# EasyEDA Pro project ProPrj_UNO2FL32x8_COMM_pro_2026-06-11.epro, schematic ISC_UNO2FL32x8_COMM_1
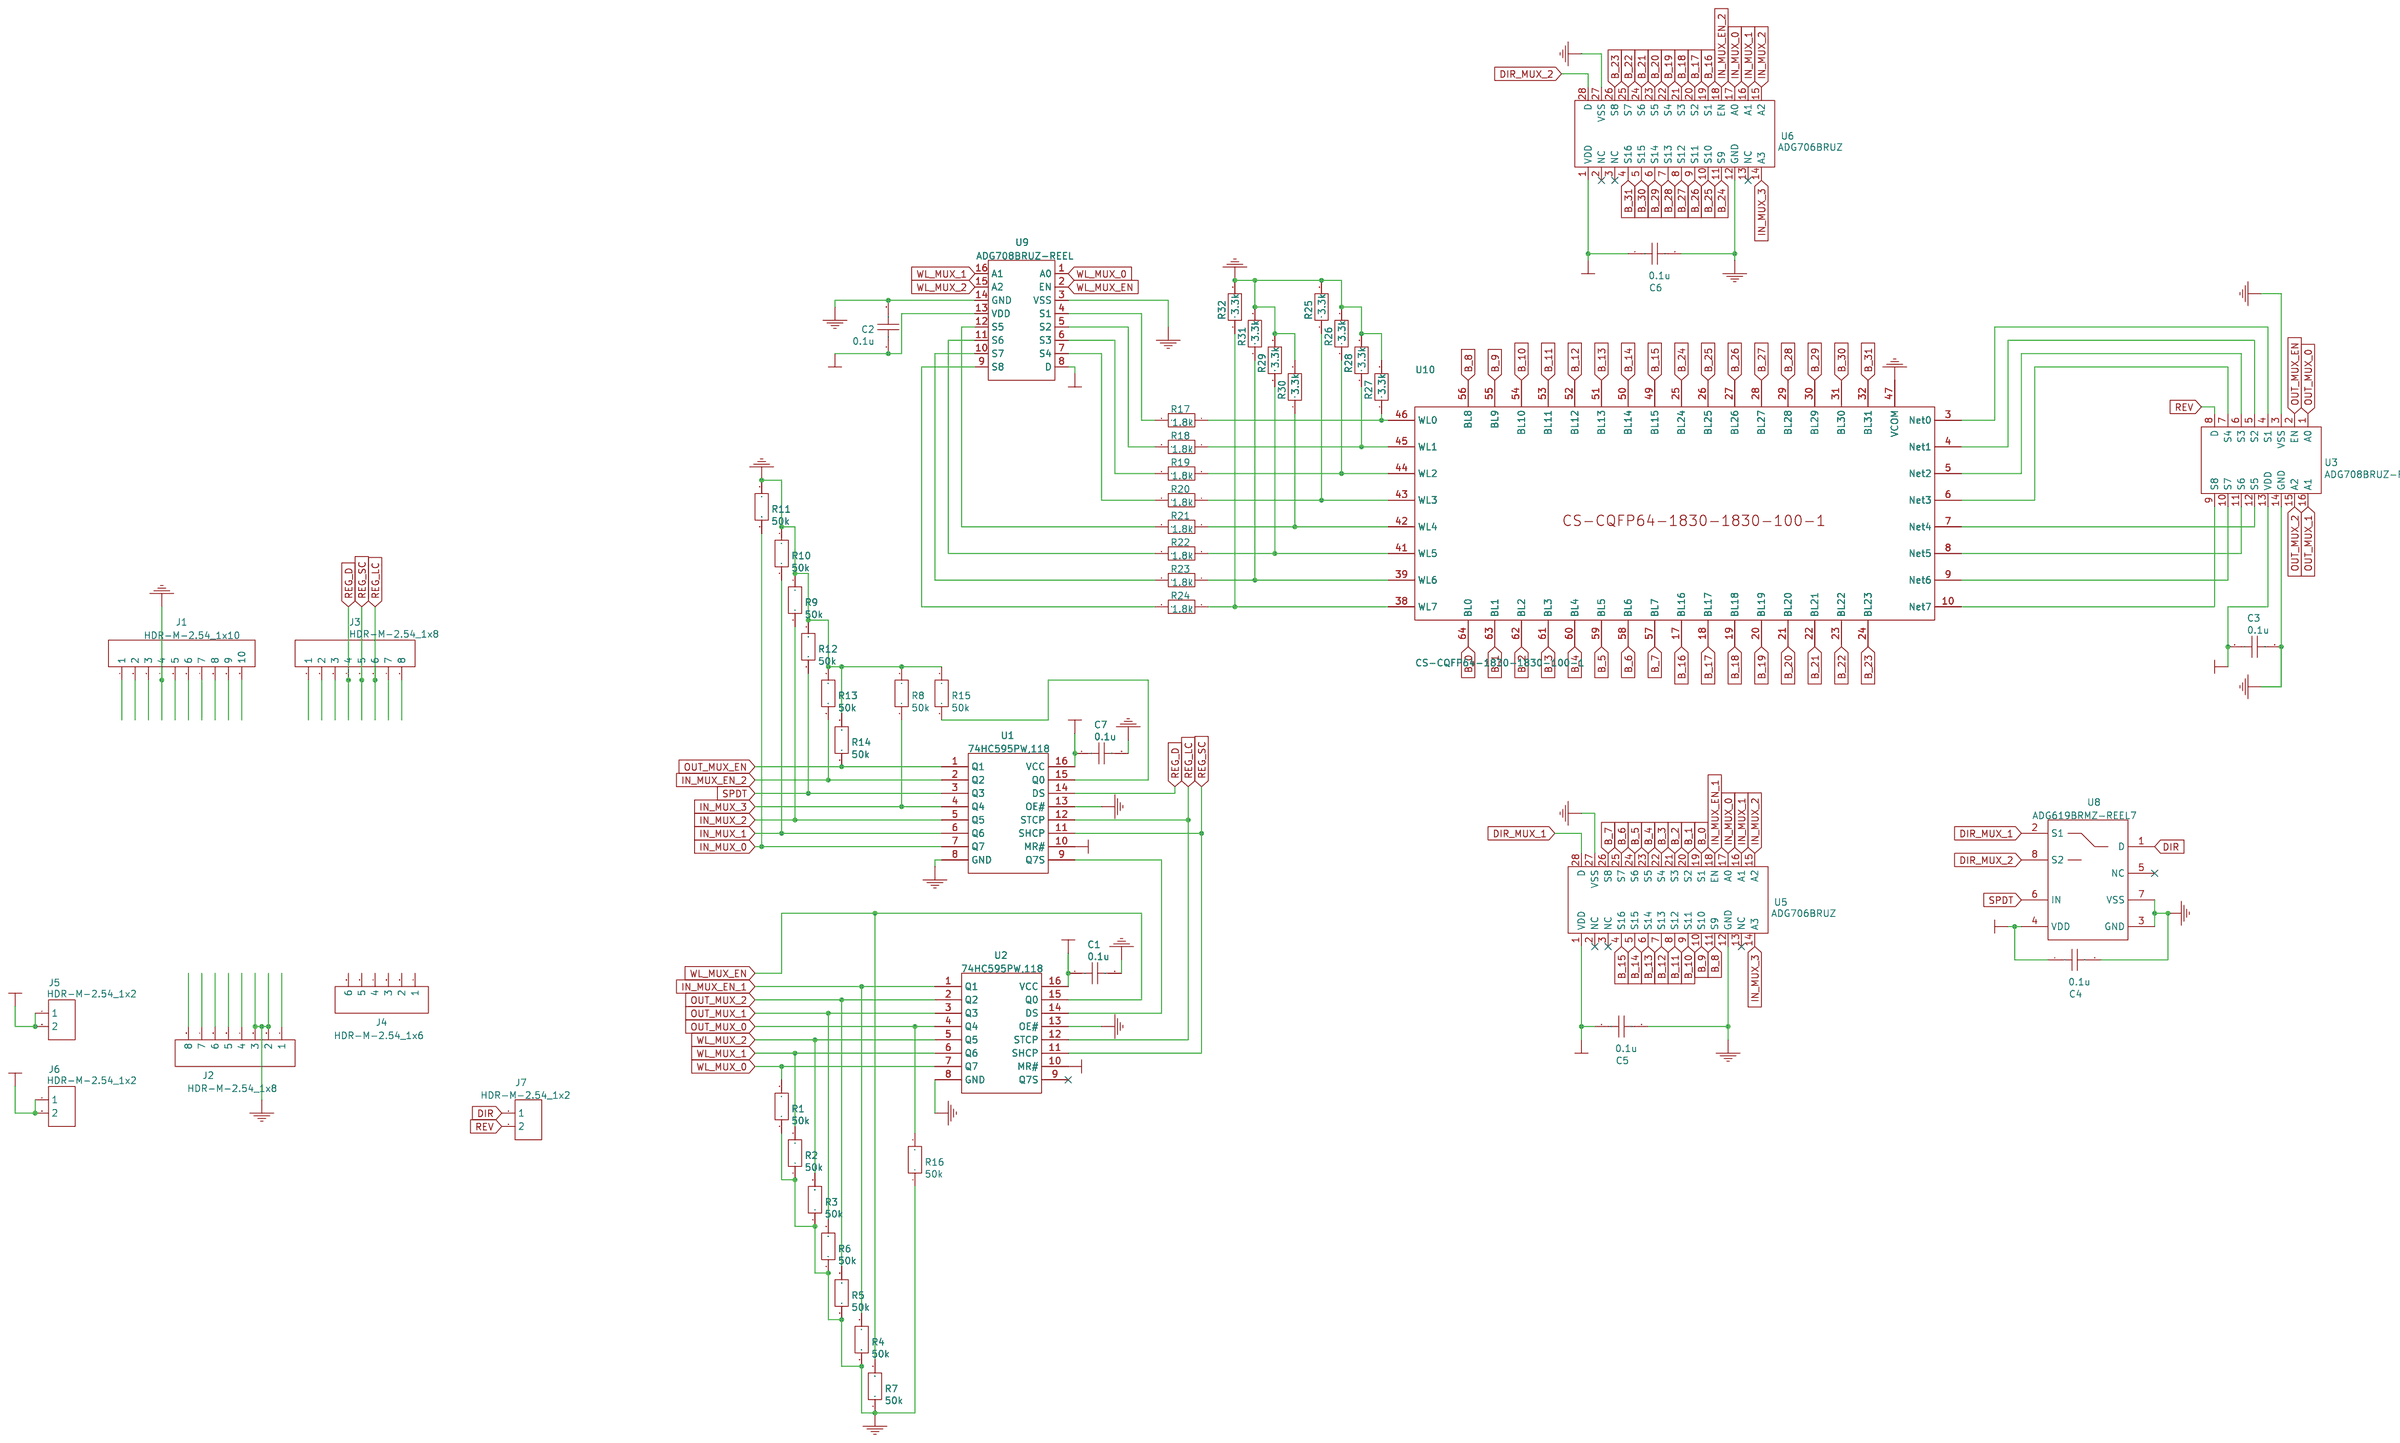
[diagram p0: schematic sheet]

## Parts
C1  0.1u  [C0805]
C2  0.1u  [C0805]
C3  0.1u  [C0805]
C4  0.1u  [C0805]
C5  0.1u  [C0805]
C6  0.1u  [C0805]
C7  0.1u  [C0805]
J1  HDR-M-2.54_1x10  [HDR-M-2.54_1X10]
J2  HDR-M-2.54_1x8  [HDR-M-2.54_1X8]
J3  HDR-M-2.54_1x8  [HDR-M-2.54_1X8]
J4  HDR-M-2.54_1x6  [HDR-M-2.54_1X6]
J5  HDR-M-2.54_1x2  [HDR-M-2.54_1X2]
J6  HDR-M-2.54_1x2  [HDR-M-2.54_1X2]
J7  HDR-M-2.54_1x2  [HDR-M-2.54_1X2]
R1  50k  [R1206]
R2  50k  [R1206]
R3  50k  [R1206]
R4  50k  [R1206]
R5  50k  [R1206]
R6  50k  [R1206]
R7  50k  [R1206]
R8  50k  [R1206]
R9  50k  [R1206]
R10  50k  [R1206]
R11  50k  [R1206]
R12  50k  [R1206]
R13  50k  [R1206]
R14  50k  [R1206]
R15  50k  [R1206]
R16  50k  [R1206]
R17  1.8k  [R1206]
R18  1.8k  [R1206]
R19  1.8k  [R1206]
R20  1.8k  [R1206]
R21  1.8k  [R1206]
R22  1.8k  [R1206]
R23  1.8k  [R1206]
R24  1.8k  [R1206]
R25  3.3k  [R1206]
R26  3.3k  [R1206]
R27  3.3k  [R1206]
R28  3.3k  [R1206]
R29  3.3k  [R1206]
R30  3.3k  [R1206]
R31  3.3k  [R1206]
R32  3.3k  [R1206]
U1  74HC595PW,118  [TSSOP-16_L5.0-W4.4-P0.65-LS6.4-BL]
U2  74HC595PW,118  [TSSOP-16_L5.0-W4.4-P0.65-LS6.4-BL]
U3  ADG708BRUZ-REEL  [TSSOP-16_L5.0-W4.4-P0.65-LS6.4-BL]
U5  ADG706BRUZ  [TSSOP-28_L9.7-W4.4-P0.65-LS6.4-BL]
U6  ADG706BRUZ  [TSSOP-28_L9.7-W4.4-P0.65-LS6.4-BL]
U8  ADG619BRMZ-REEL7  [MSOP-8_L3.0-W3.0-P0.65-LS4.9-TL]
U9  ADG708BRUZ-REEL  [TSSOP-16_L5.0-W4.4-P0.65-LS6.4-BL]
U10  CS-CQFP64-1830-1830-100-1  [ICS-CQFP64-1830-1830-100-1]

## Library data of the parts
C1-C7 = 0.1u
J1 = HDR-M-2.54_1x10: Supplier Part: C57369; Supplier: LCSC
J2 J3 = HDR-M-2.54_1x8: Supplier Part: C190820; Supplier: LCSC
J4 = HDR-M-2.54_1x6: Supplier Part: C190819; Supplier: LCSC
J5-J7 = HDR-M-2.54_1x2: Supplier Part: C124375; Supplier: LCSC
R1-R16 = 50k
R17-R24 = 1.8k
R25-R32 = 3.3k
U1 U2 = 74HC595PW,118: Supplier: LCSC; Manufacturer: Nexperia(安世); Supplier Part: C5948; JLCPCB Part Class: Extended Part
U3 U9 = ADG708BRUZ-REEL: Supplier: LCSC; Supplier Part: C657577; Manufacturer: ADI(亚德诺); JLCPCB Part Class: Extended Part
U5 U6 = ADG706BRUZ: Supplier: LCSC; Supplier Part: C408400; Manufacturer: ADI(亚德诺)/LINEAR(凌特); Manufacturer Part: ADG706BRUZ-REEL7; JLCPCB Part Class: Extended Part
U8 = ADG619BRMZ-REEL7: Supplier: LCSC; Manufacturer: ADI(亚德诺)/LINEAR(凌特); Supplier Part: C141957; JLCPCB Part Class: Extended Part
U10 = CS-CQFP64-1830-1830-100-1

## Nets
GND: C1.2 C2.2 C3.2 C4.2 C5.2 C6.2 C7.2 J1.4 J2.2 J2.3 R1.1 R2.1 R3.1 R4.1 R5.1 R6.1 R7.1 R8.1 R9.1 R10.1 R11.1 R12.1 R13.1 R14.1 R15.1 R16.1 R25.2 R26.2 R27.2 R28.2 R29.2 R30.2 R31.2 R32.2 U1.8(GND) U1.13(OE#) U2.8(GND) U2.13(OE#) U3.3(VSS) U3.14(GND) U5.12(GND) U5.27(VSS) U6.12(GND) U6.27(VSS) U8.3(GND) U8.7(VSS) U9.3(VSS) U9.14(GND) U10.47(VCOM)
VCCA: C2.1 C3.1 C4.1 C5.1 C6.1 J6.1 J6.2 U3.13(VDD) U5.1(VDD) U6.1(VDD) U8.4(VDD) U9.8(D) U9.13(VDD)
VCCD: C1.1 C7.1 J5.1 J5.2 U1.10(MR#) U1.16(VCC) U2.10(MR#) U2.16(VCC)
B_0: U5.19(S1) U10.64(BL0)
B_1: U5.20(S2) U10.63(BL1)
B_2: U5.21(S3) U10.62(BL2)
B_3: U5.22(S4) U10.61(BL3)
B_4: U5.23(S5) U10.60(BL4)
B_5: U5.24(S6) U10.59(BL5)
B_6: U5.25(S7) U10.58(BL6)
B_7: U5.26(S8) U10.57(BL7)
B_8: U5.11(S9) U10.56(BL8)
B_9: U5.10(S10) U10.55(BL9)
B_10: U5.9(S11) U10.54(BL10)
B_11: U5.8(S12) U10.53(BL11)
B_12: U5.7(S13) U10.52(BL12)
B_13: U5.6(S14) U10.51(BL13)
B_14: U5.5(S15) U10.50(BL14)
B_15: U5.4(S16) U10.49(BL15)
B_16: U6.19(S1) U10.17(BL16)
B_17: U6.20(S2) U10.18(BL17)
B_18: U6.21(S3) U10.19(BL18)
B_19: U6.22(S4) U10.20(BL19)
B_20: U6.23(S5) U10.21(BL20)
B_21: U6.24(S6) U10.22(BL21)
B_22: U6.25(S7) U10.23(BL22)
B_23: U6.26(S8) U10.24(BL23)
B_24: U6.11(S9) U10.25(BL24)
B_25: U6.10(S10) U10.26(BL25)
B_26: U6.9(S11) U10.27(BL26)
B_27: U6.8(S12) U10.28(BL27)
B_28: U6.7(S13) U10.29(BL28)
B_29: U6.6(S14) U10.30(BL29)
B_30: U6.5(S15) U10.31(BL30)
B_31: U6.4(S16) U10.32(BL31)
DIR: J7.1 U8.1(D)
DIR_MUX_1: U5.28(D) U8.2(S1)
DIR_MUX_2: U6.28(D) U8.8(S2)
IN_MUX_0: R11.2 U1.7(Q7) U5.17(A0) U6.17(A0)
IN_MUX_1: R10.2 U1.6(Q6) U5.16(A1) U6.16(A1)
IN_MUX_2: R9.2 U1.5(Q5) U5.15(A2) U6.15(A2)
IN_MUX_3: R8.2 U1.4(Q4) U5.14(A3) U6.14(A3)
IN_MUX_EN_1: R4.2 U2.1(Q1) U5.18(EN)
IN_MUX_EN_2: R13.2 U1.2(Q2) U6.18(EN)
OUT_MUX_0: R16.2 U2.4(Q4) U3.1(A0)
OUT_MUX_1: R6.2 U2.3(Q3) U3.16(A1)
OUT_MUX_2: R5.2 U2.2(Q2) U3.15(A2)
OUT_MUX_EN: R14.2 U1.1(Q1) U3.2(EN)
REG_D: J3.4 U1.14(DS)
REG_LC: J3.6 U1.12(STCP) U2.12(STCP)
REG_SC: J3.5 U1.11(SHCP) U2.11(SHCP)
REV: J7.2 U3.8(D)
SPDT: R12.2 U1.3(Q3) U8.6(IN)
WL_MUX_0: R1.2 U2.7(Q7) U9.1(A0)
WL_MUX_1: R2.2 U2.6(Q6) U9.16(A1)
WL_MUX_2: R3.2 U2.5(Q5) U9.15(A2)
WL_MUX_EN: R7.2 U2.15(Q0) U9.2(EN)
$1N32: U1.9(Q7S) U2.14(DS)
$1N59: U3.4(S1) U10.3(Net0)
$1N60: U3.5(S2) U10.4(Net1)
$1N61: U3.6(S3) U10.5(Net2)
$1N62: U3.7(S4) U10.6(Net3)
$1N63: U3.12(S5) U10.7(Net4)
$1N64: U3.11(S6) U10.8(Net5)
$1N65: U3.10(S7) U10.9(Net6)
$1N66: U3.9(S8) U10.10(Net7)
$1N84: R15.2 U1.15(Q0)
$1N86: R17.2 U9.4(S1)
$1N87: R17.1 R27.1 U10.46(WL0)
$1N88: R18.2 U9.5(S2)
$1N89: R18.1 R28.1 U10.45(WL1)
$1N90: R19.2 U9.6(S3)
$1N91: R19.1 R26.1 U10.44(WL2)
$1N92: R20.2 U9.7(S4)
$1N93: R20.1 R25.1 U10.43(WL3)
$1N94: R21.1 R30.1 U10.42(WL4)
$1N95: R21.2 U9.12(S5)
$1N96: R22.2 U9.11(S6)
$1N97: R22.1 R29.1 U10.41(WL5)
$1N98: R23.2 U9.10(S7)
$1N99: R23.1 R31.1 U10.39(WL6)
$1N100: R24.1 R32.1 U10.38(WL7)
$1N101: R24.2 U9.9(S8)

Not connected (* = marked no-connect by the designer): J1 1 2 3 5 6 7 8 9 10; J2 1 4 5 6 7 8; J3 1 2 3 7 8; J4 1 2 3 4 5 6; U2 9(Q7S)*; U5 2(NC)* 3(NC)* 13(NC)*; U6 2(NC)* 3(NC)* 13(NC)*; U8 5(NC)*
